# Altium schematic sheet ORD_PT2399.SchDoc
size 420 x 297 mm; Address1: Address1; Address2: Address2; Address3: Address3; Address4: Address4; DocumentNumber: АБВГ.123456.001 Э3; SheetNumber: 1; Scale: 1:1; DocumentType: Схема электрическая принципиальная; FirstReferrence: АБВГ.123456.001
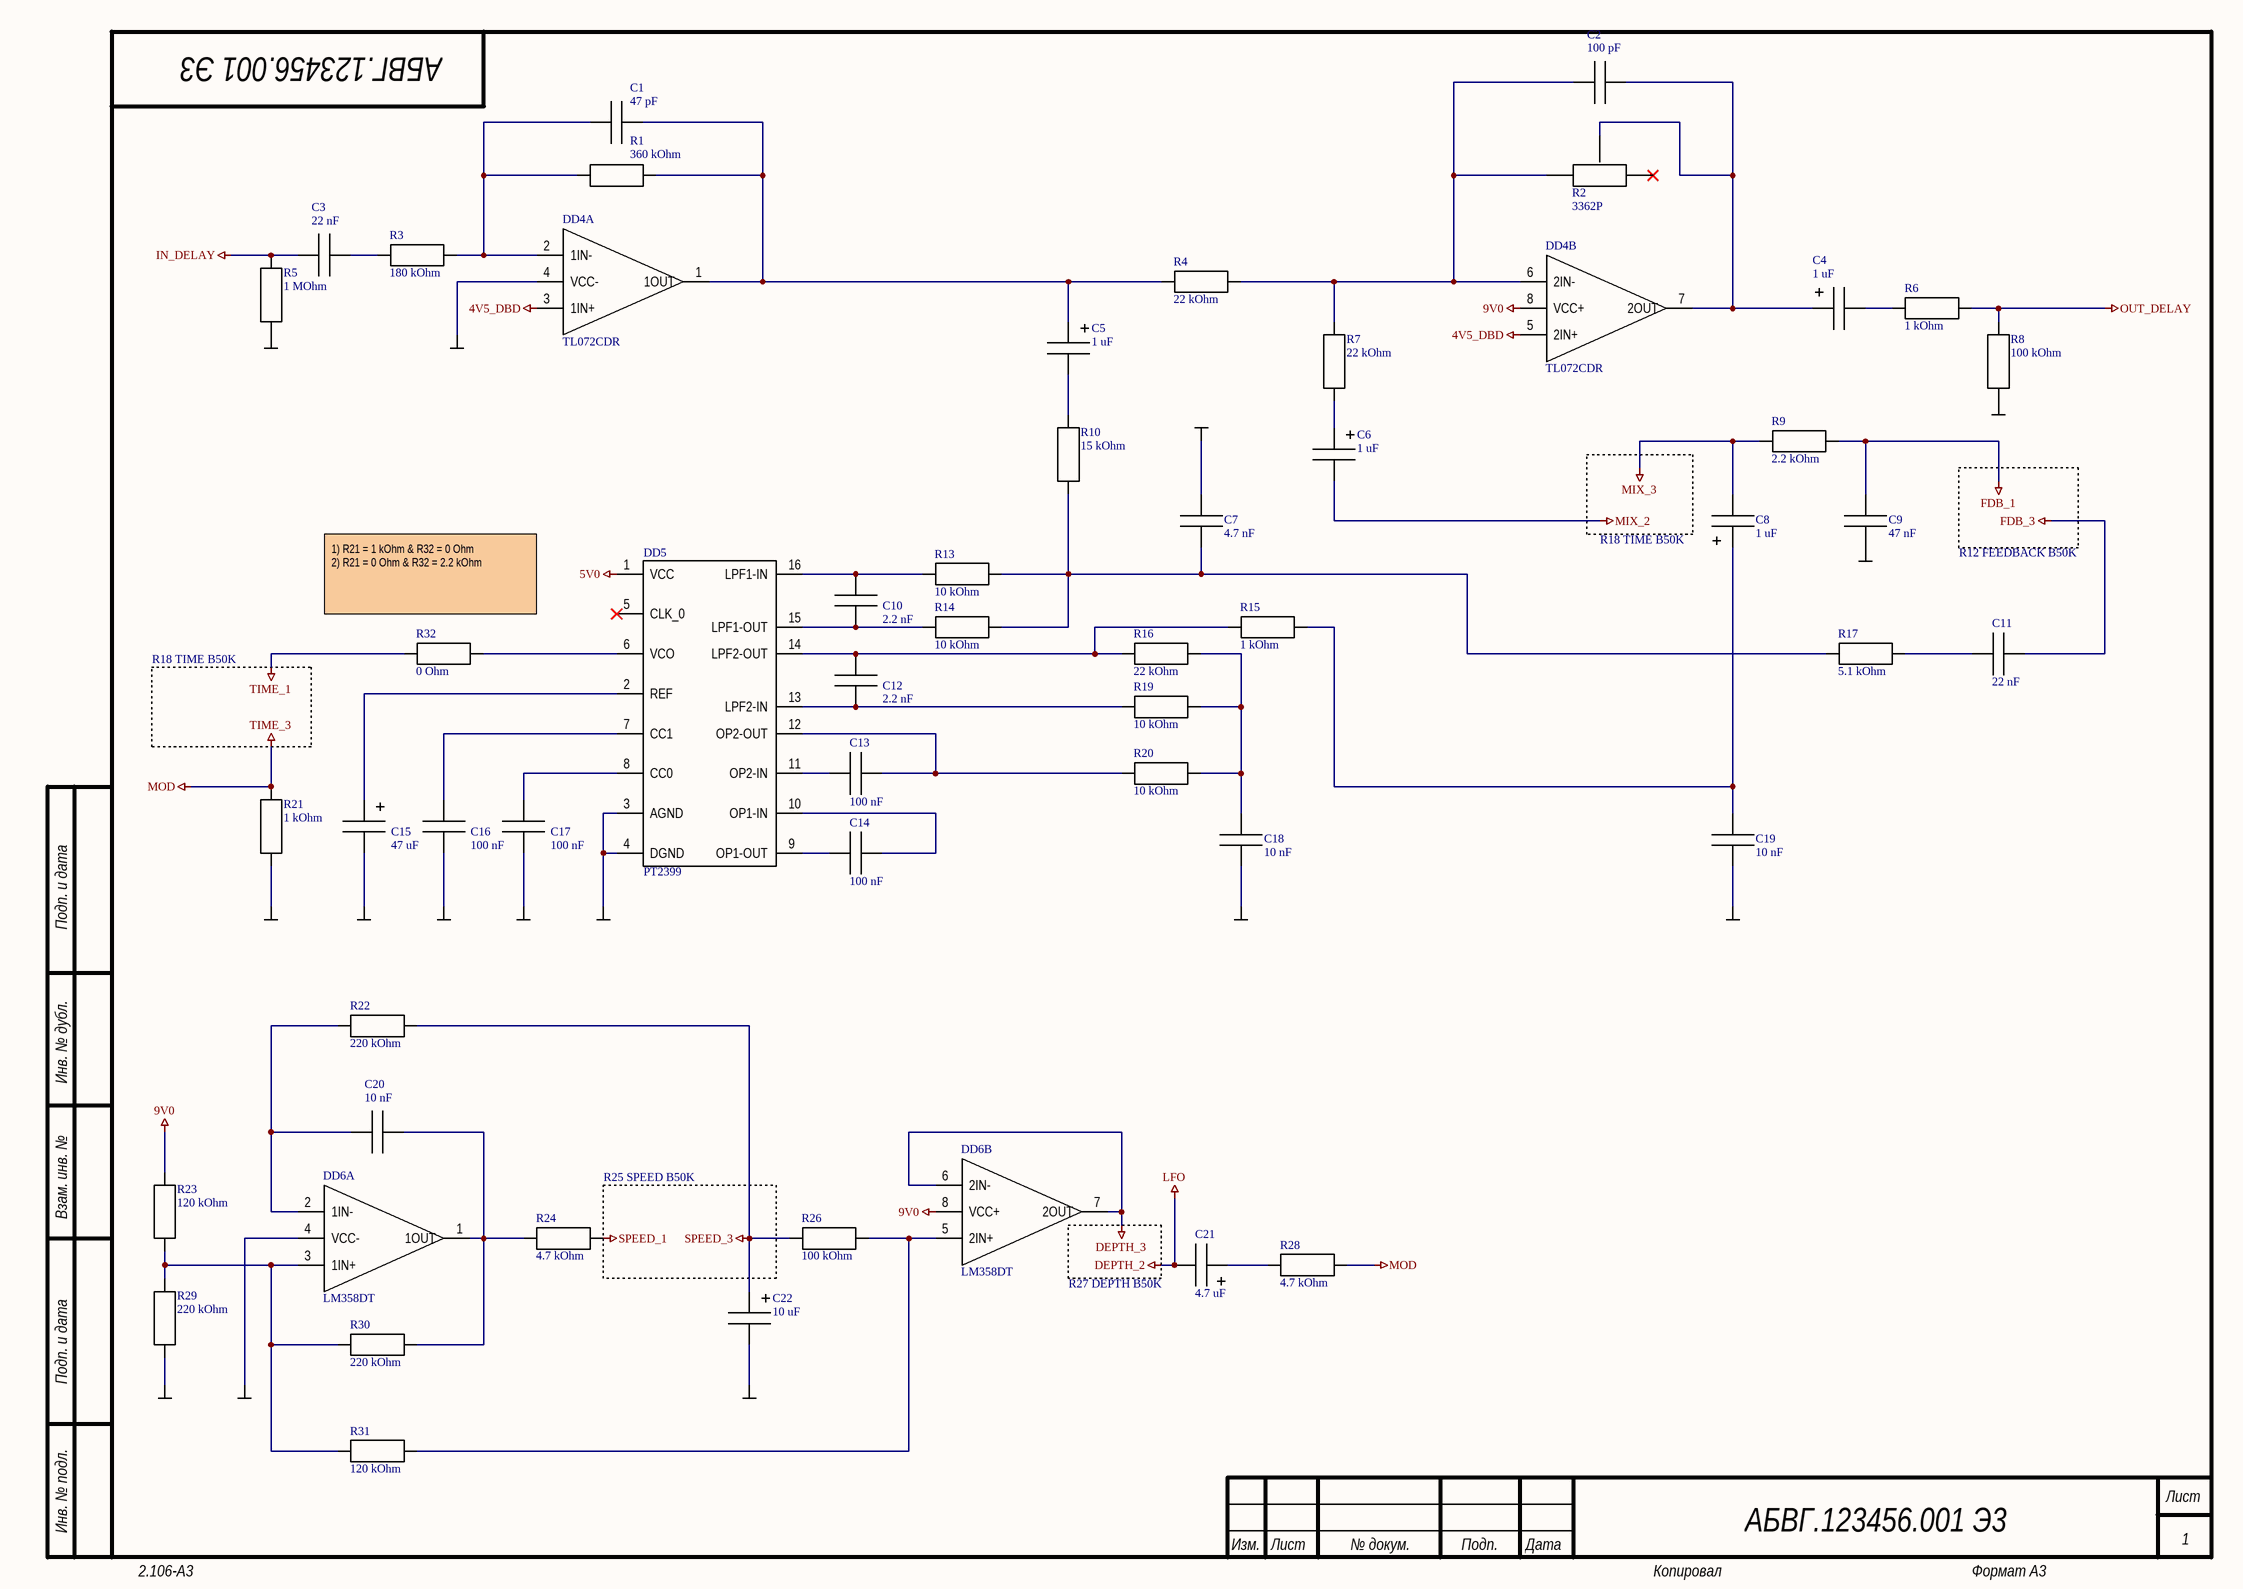
[diagram p0: ORD_PT2399.SchDoc]

## Parts
C1  47 pF  [C0805[2012]]
C2  100 pF  [C0805[2012]]
C3  22 nF  [C0805[2012]]
C4  1 uF  [C3216_CASE-A]
C5  1 uF  [C3216_CASE-A]
C6  1 uF  [C3216_CASE-A]
C7  4.7 nF  [C0805[2012]]
C8  1 uF  [C3216_CASE-A]
C9  47 nF  [C0805[2012]]
C10  2.2 nF  [C0805[2012]]
C11  22 nF  [C0805[2012]]
C12  2.2 nF  [C0805[2012]]
C13  100 nF  [C0805[2012]]
C14  100 nF  [C0805[2012]]
C15  47 uF  [C3216_CASE-A]
C16  100 nF  [C0805[2012]]
C17  100 nF  [C0805[2012]]
C18  10 nF  [C0805[2012]]
C19  10 nF  [C0805[2012]]
C20  10 nF  [C0805[2012]]
C21  4.7 uF  [C3216_CASE-A]
C22  10 uF  [C3216_CASE-A]
DD4  TL072CDR  [SO8]  (parts A,B of 2)
DD5  PT2399  [DIP16_with_Socket]
DD6  LM358DT  [SO8]  (parts A,B of 2)
R1  360 kOhm  [R0805[2012]]
R2  3362P  [3362p]
R3  180 kOhm  [R0805[2012]]
R4  22 kOhm  [R0805[2012]]
R5  1 MOhm  [R0805[2012]]
R6  1 kOhm  [R0805[2012]]
R7  22 kOhm  [R0805[2012]]
R8  100 kOhm  [R0805[2012]]
R9  2.2 kOhm  [R0805[2012]]
R10  15 kOhm  [R0805[2012]]
R13  10 kOhm  [R0805[2012]]
R14  10 kOhm  [R0805[2012]]
R15  1 kOhm  [R0805[2012]]
R16  22 kOhm  [R0805[2012]]
R17  5.1 kOhm  [R0805[2012]]
R19  10 kOhm  [R0805[2012]]
R20  10 kOhm  [R0805[2012]]
R21  1 kOhm  [R0805[2012]]
R22  220 kOhm  [R0805[2012]]
R23  120 kOhm  [R0805[2012]]
R24  4.7 kOhm  [R0805[2012]]
R26  100 kOhm  [R0805[2012]]
R28  4.7 kOhm  [R0805[2012]]
R29  220 kOhm  [R0805[2012]]
R30  220 kOhm  [R0805[2012]]
R31  120 kOhm  [R0805[2012]]
R32  0 Ohm  [R0805[2012]]

## Nets
4V5_DBD: DD4.3(1IN+) DD4.5(2IN+)
5V0: DD5.1(VCC)
9V0: DD4.8(VCC+) DD6.8(VCC+) R23.1
DEPTH_2: C21.2  [also labelled LFO]
DEPTH_3: DD6.6(2IN-) DD6.7(2OUT)
FDB_1: C9.1 R9.2
FDB_3: C11.2
GND: C7.1 C9.2 C15.2 C16.1 C17.1 C18.2 C19.2 C22.2 DD4.4(VCC-) DD5.3(AGND) DD5.4(DGND) DD6.4(VCC-) R5.1 R8.2 R21.1 R29.2
IN_DELAY: C3.1 R5.2
MIX_2: C6.2
MIX_3: C8.2 R9.1
MOD: R21.2 R28.2  [also labelled TIME_3]
OUT_DELAY: R6.1 R8.1
SPEED_1: R24.2
SPEED_3: C22.1 R22.2 R26.1
TIME_1: R32.2
NetC1_1: C1.1 DD4.2(1IN-) R1.2 R3.1
NetC1_2: C1.2 C5.1 DD4.1(1OUT) R1.1 R4.2
NetC2_1: C2.1 DD4.6(2IN-) R2.1 R4.1 R7.1
NetC2_2: C2.2 C4.1 DD4.7(2OUT) R2.2
NetC3_2: C3.2 R3.2
NetC4_2: C4.2 R6.2
NetC5_2: C5.2 R10.1
NetC6_1: C6.1 R7.2
NetC7_2: C7.2 R10.2 R13.2 R14.2 R17.1
NetC8_1: C8.1 C19.1 R15.2
NetC10_1: C10.1 DD5.15(LPF1-OUT) R14.1
NetC10_2: C10.2 DD5.16(LPF1-IN) R13.1
NetC11_1: C11.1 R17.2
NetC12_1: C12.1 DD5.13(LPF2-IN) R19.1
NetC12_2: C12.2 DD5.14(LPF2-OUT) R15.1 R16.1
NetC13_1: C13.1 DD5.12(OP2-OUT) R20.1
NetC13_2: C13.2 DD5.11(OP2-IN)
NetC14_1: C14.1 DD5.10(OP1-IN)
NetC14_2: C14.2 DD5.9(OP1-OUT)
NetC15_1: C15.1 DD5.2(REF)
NetC16_2: C16.2 DD5.7(CC1)
NetC17_2: C17.2 DD5.8(CC0)
NetC18_1: C18.1 R16.2 R19.2 R20.2
NetC20_1: C20.1 DD6.2(1IN-) R22.1
NetC20_2: C20.2 DD6.1(1OUT) R24.1 R30.2
NetC21_1: C21.1 R28.1
NetDD5_6: DD5.6(VCO) R32.1
NetDD6_3: DD6.3(1IN+) R23.2 R29.1 R30.1 R31.1
NetDD6_5: DD6.5(2IN+) R26.2 R31.2

Not connected (* = marked no-connect by the designer): DD5 5(CLK_0)*; R2 3*

## Notes on the sheet
- R18 TIME B50K
- R12 FEEDBACK B50K
- (near R32) 1) R21 = 1 kOhm & R32 = 0 Ohm
  2) R21 = 0 Ohm & R32 = 2.2 kOhm
- R25 SPEED B50K
- R27 DEPTH B50K
- Подп. и дата
- Инв. № дубл.
- Взам. инв. №
- Инв. № подл.
- Изм.
- Лист
- № докум.
- Подп.
- Дата
- 2.106-A3
- Копировал
- Формат А3

## Library data of the parts
C1-C3 C7 C9-C14 C16-C20 = Capacitor: Manufacture: *; ManufacturerPartNumber: *; Power/Voltage: *; Quantity: *; Rem: *; TKE: *; Tolerance: *; Корпус: *; Примечание: *
  C1: Value: 47 pF
  C2: Value: 100 pF
  C3 C11: Value: 22 nF
  C7: Value: 4.7 nF
  C9: Value: 47 nF
  C10 C12: Value: 2.2 nF
  C13 C14 C16 C17: Value: 100 nF
  C18-C20: Value: 10 nF
C4-C6 C8 C15 C21 C22 = Capacitor_Pol: Manufacture: *; ManufacturerPartNumber: *; Power/Voltage: *; Quantity: *; Rem: *; TKE: *; Tolerance: *; Корпус: *; Примечание: *
  C4-C6 C8: Value: 1 uF
  C15: Value: 47 uF
  C21: Value: 4.7 uF
  C22: Value: 10 uF
DD4 = TL072CDR: TL072CDR, Dual Operational Amplifier 4 MHz -18 to 18V, 8-Pin SO; Manufacturer_Name: STMicroelectronics; Manufacturer_Part_Number: LM358DT; Allied_Number: 70013708; Geometry.Height: 1.75mm; Mouser Part Number: 511-LM358DT; Mouser Price/Stock: https://www.mouser.com/Search/Refine.aspx?Keyword=511-LM358DT; RS Part Number: 7140827P; RS Price/Stock: http://uk.rs-online.com/web/p/products/7140827P; Allied Price/Stock: http://www.alliedelec.com/stmicroelectronics-lm358dt/70013708/; Datasheet Link: http://www.st.com/st-web-ui/static/active/en/resource/technical/document/datasheet/CD00000464.pdf
DD5 = PT2399: Echo Processor IC; Manufacturer_Name: Princeton Technology Corp; Geometry.Height: 5.33mm; Manufacturer_Part_Number: PT2399; Mouser Part Number: *; Mouser Price/Stock: *; RS Part Number: *; RS Price/Stock: *; Datasheet Link: http://www.princeton.com.tw/Portals/0/Product/PT2399_1.pdf
DD6 = LM358DT: LM358DT, Dual Operational Amplifier 1.1MHz 5 to 28V, 8-Pin SO; Manufacturer_Name: STMicroelectronics; Allied_Number: 70013708; Geometry.Height: 1.75mm; Manufacturer_Part_Number: LM358DT; Mouser Part Number: 511-LM358DT; Mouser Price/Stock: https://www.mouser.com/Search/Refine.aspx?Keyword=511-LM358DT; RS Part Number: 7140827P; RS Price/Stock: http://uk.rs-online.com/web/p/products/7140827P; Allied Price/Stock: http://www.alliedelec.com/stmicroelectronics-lm358dt/70013708/; Datasheet Link: http://www.st.com/st-web-ui/static/active/en/resource/technical/document/datasheet/CD00000464.pdf
R1 R3-R10 R13-R17 R19-R24 R26 R28-R32 = Resistor: Manufacture: *; ManufacturerPartNumber: *; Power/Voltage: *; Quantity: *; Rem: *; TKE: *; Tolerance: *; Корпус: *; Примечание: *
  R1: Value: 360 kOhm
  R3: Value: 180 kOhm
  R4 R7 R16: Value: 22 kOhm
  R5: Value: 1 MOhm
  R6 R15 R21: Value: 1 kOhm
  R8 R26: Value: 100 kOhm
  R9: Value: 2.2 kOhm
  R10: Value: 15 kOhm
  R13 R14 R19 R20: Value: 10 kOhm
  R17: Value: 5.1 kOhm
  R22 R29 R30: Value: 220 kOhm
  R23 R31: Value: 120 kOhm
  R24 R28: Value: 4.7 kOhm
  R32: Value: 0 Ohm
R2 = 3362P: Value: *; Function: *